# Altium schematic sheet Display.SchDoc
size A4; SheetNumber: 2; SheetTotal: 5
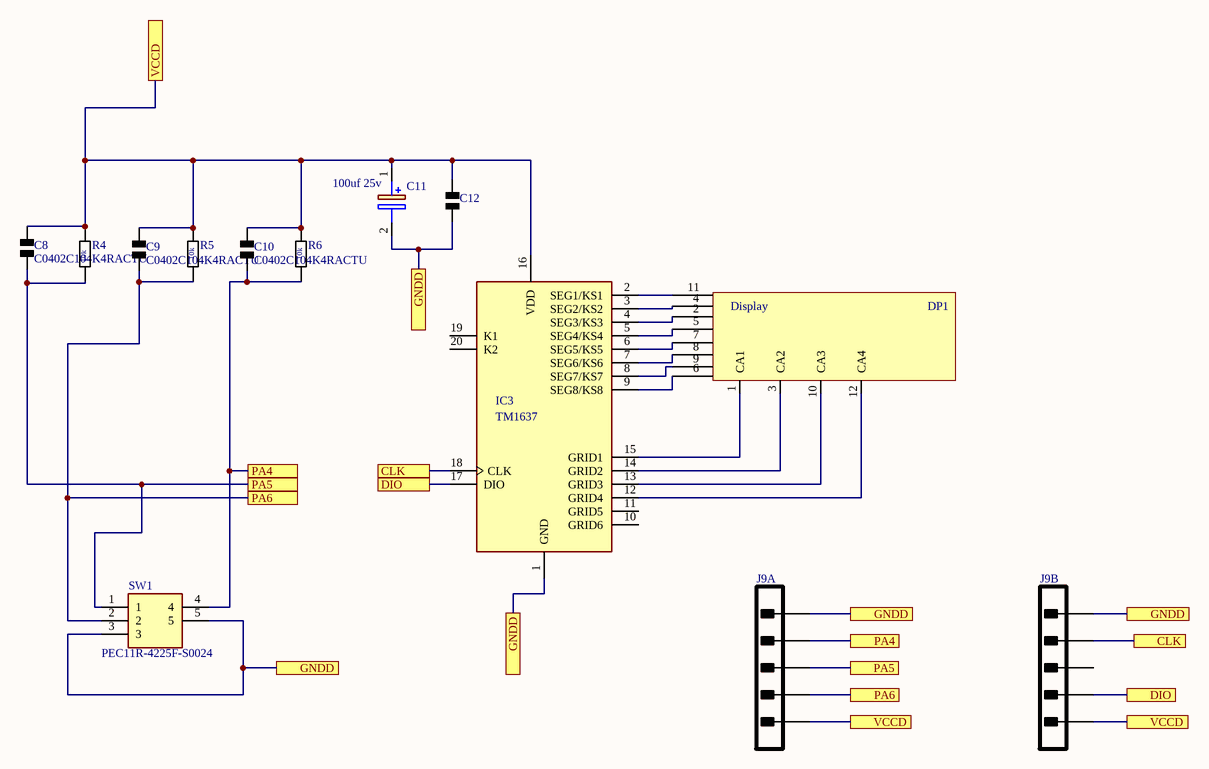
[diagram p0: Display.SchDoc]

## Parts
C8  C0402C104K4RACTU  [Capacitor]
C9  C0402C104K4RACTU  [Capacitor]
C10  C0402C104K4RACTU  [Capacitor]
C11  100uf 25v  [100uf 25v]
C12  C0402C104K4RACTU  [Capacitor]  (value not drawn)
DP1  Display  [DIP12]
IC3  TM1637  [TM1637]
J9A  K9 5Pinheader  [K9 5Pinheader]  (value not drawn)
J9B  K9 5Pinheader  [K9 5Pinheader]  (value not drawn)
R4  10k  [Resistor]
R5  10k  [Resistor]
R6  10k  [Resistor]
SW1  PEC11R-4225F-S0024  [PEC11 S1]

## Ports
CLK (see Display[2C]), CLK (see Display[4C]), DIO (see Display[2C]), DIO (see Display[4D]), GNDD (see Display[2B], Display[2C], Display[3C]), GNDD (see Display[2B], Display[2C], Display[3C], Display[4C]), GNDD (see Display[2B], Display[3C], Display[4C]), GNDD (see Display[2C], Display[3C], Display[4C]), PA4 (see Display[2C]), PA4 (see Display[3C]), PA5 (see Display[2C]), PA5 (see Display[3C]), PA6 (see Display[2C]), PA6 (see Display[3D]), VCCD (see Display[2A], Display[3D]), VCCD (see Display[2A], Display[4D]), VCCD (see Display[3D], Display[4D])

## Nets
CLK: IC3.18(CLK) J9B.2 ; port CLK
DIO: IC3.17(DIO) J9B.4 ; port DIO
GNDD: C11.2(-) C12.1 IC3.1(GND) J9A.1 J9B.1 SW1.3 SW1.5 ; port GNDD
PA4: C10.1 J9A.2 R6.1 SW1.4 ; port PA4
PA5: C8.1 J9A.3 R4.1 SW1.1 ; port PA5
PA6: C9.1 J9A.4 R5.1 SW1.2 ; port PA6
VCCD: C8.2 C9.2 C10.2 C11.1(+) C12.2 IC3.16(VDD) J9A.5 J9B.5 R4.2 R5.2 R6.2 ; port VCCD
NetDP1_1: DP1.1(CA1) IC3.15(GRID1)
NetDP1_2: DP1.2 IC3.4(SEG3/KS3)
NetDP1_3: DP1.3(CA2) IC3.14(GRID2)
NetDP1_4: DP1.4 IC3.3(SEG2/KS2)
NetDP1_5: DP1.5 IC3.5(SEG4/KS4)
NetDP1_6: DP1.6 IC3.9(SEG8/KS8)
NetDP1_7: DP1.7 IC3.6(SEG5/KS5)
NetDP1_8: DP1.8 IC3.7(SEG6/KS6)
NetDP1_9: DP1.9 IC3.8(SEG7/KS7)
NetDP1_10: DP1.10(CA3) IC3.13(GRID3)
NetDP1_11: DP1.11 IC3.2(SEG1/KS1)
NetDP1_12: DP1.12(CA4) IC3.12(GRID4)

Not connected (* = marked no-connect by the designer): IC3 10(GRID6) 11(GRID5) 19(K1) 20(K2); J9B 3

## Library data of the parts
C8-C10 C12 = Condensator: Manufacturer: Kemet; Part Number: C0402C104K4RACTU
C11 = 100uf 25v: Capacitor Polarised; Manufacturer_Name: Chemi-Con; Manufacturer_Part_Number: ESMG250ELL101MF11D; Datasheet Link: http://www.chemi-con.co.jp/cgi-bin/CAT_DB/SEARCH/cat_db_al.cgi?e=e&j=p&pdfname=smg; Height: 12.5mm; Mouser Part Number: 661-ESMG250ELL101MF; Mouser Price/Stock: https://www.mouser.co.uk/ProductDetail/Chemi-Con/ESMG250ELL101MF11D?qs=46VwSHQt9xX2tXRf6ZkiIw%3D%3D; Arrow Part Number: ESMG250ELL101MF11D; Arrow Price/Stock: https://www.arrow.com/en/products/esmg250ell101mf11d/united-chemi-con?region=nac
IC3 = TM1637: MF: Titan Micro Electronics; Package: Package; Availability: Not in stock; SnapEDA_Link: https://www.snapeda.com/parts/TM1637/Titan+Micro+Electronics/view-part/?ref=snap; MP: TM1637; Check_prices: https://www.snapeda.com/parts/TM1637/Titan+Micro+Electronics/view-part/?ref=eda; Value: *; Price: None
J9A J9B = K9 5Pinheader: NexarPartId: 278173; Voltage Rating: 250V; Number of Contacts: 5; Contact Resistance: 20mΩ; Gender: Male; Pitch: 2.54mm; Connector Type: Male Pin; Current Rating: 4A; Glow Wire Compliant: Non-compliant; Max Voltage Rating (DC): 250.25kV; Flammability Rating: UL94 V-0; Min Operating Temperature: 0°C; REACH SVHC: Unknown; Lead Free: Lead Free; Termination: Solder; RoHS: Compliant; Schedule B: 8536694040|8536694040|8536694040|8536694040|8536694040|8536694040|8536694040|8536694040|8536694040|8536694040|8536694040|8536694040|8536694040|8536694040|8536694040|8536694040|8536694040|8536694040|8536694040|8536694040|8536694040|8536694040|8536694040|85; Number of Circuits: 5; Mount: Through Hole; Lead Pitch: 2.54mm; Height: 2.29mm; Voltage Rating (DC): 250V; Max Operating Temperature: 75°C; Width: 2.49mm; Radiation Hardening: No; Contact Plating: Tin; Orientation: Vertical; Length: 12.7mm; Number of Rows: 1; Housing Material: Thermoplastic; Contact Material: Brass; Packaging: Bulk; Contact Mating Length: 6.096mm; Housing Color: Black; Color: Black; Number of Positions: 5
R4-R6 = Resistor: Manufacturer: Vishay Dale; Part Number: CRCW08050000Z0EA
SW1 = PEC11R-4225F-S0024: Undefined or Miscellaneous; Manufacturer_Name: Bourns; Datasheet Link: https://componentsearchengine.com/Datasheets/1/PEC11R-4225F-S0024.pdf; Manufacturer_Part_Number: PEC11R-4225F-S0024; Mouser Part Number: 652-PEC11R-4225F-S24; Mouser Price/Stock: https://www.mouser.co.uk/ProductDetail/Bourns/PEC11R-4225F-S0024?qs=Zq5ylnUbLm4N6UNkPX3pkQ%3D%3D; Arrow Part Number: PEC11R-4225F-S0024; Arrow Price/Stock: https://www.arrow.com/en/products/pec11r-4225f-s0024/bourns?region=nac